# EAGLE design ControlBoardEsp (EAGLE 7.2.0)
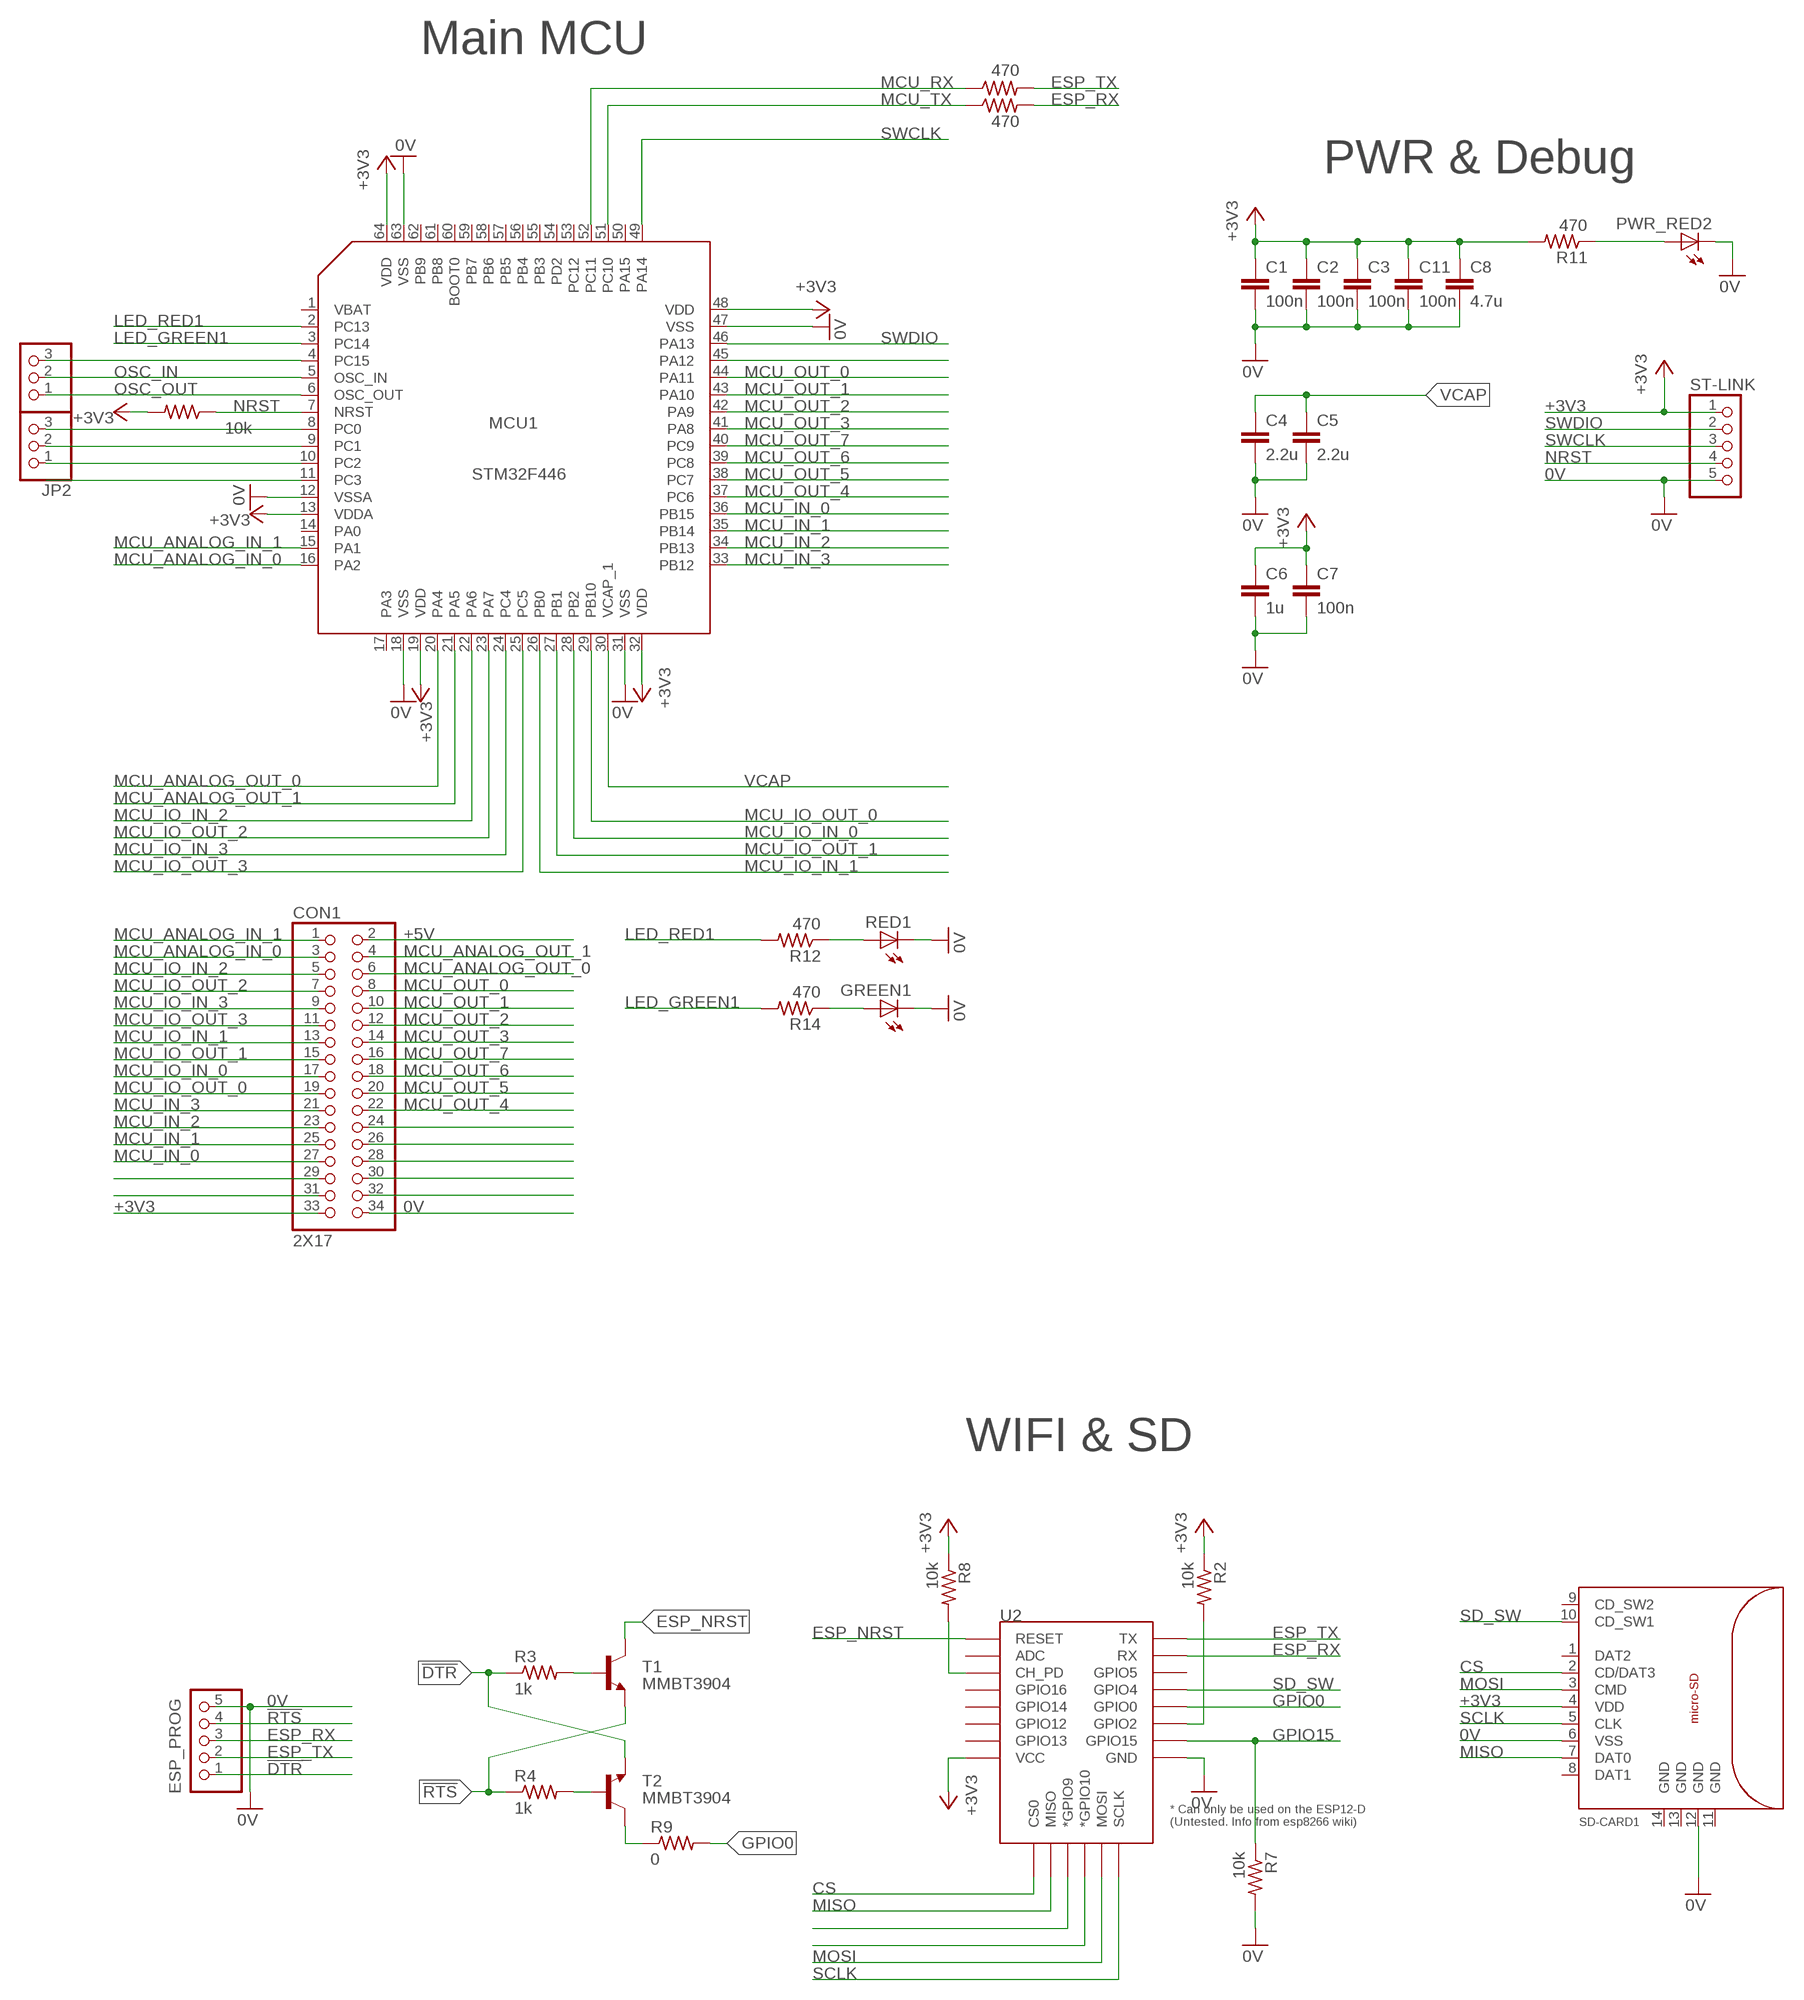
[diagram p0: schematic, sheet 1]

## Parts
C1  100n  C-EUC0402  [C0402]
C2  100n  C-EUC0402  [C0402]
C3  100n  C-EUC0402  [C0402]
C4  2.2u  C-EUC0402  [C0402]
C5  2.2u  C-EUC0402  [C0402]
C6  1u  C-EUC0402  [C0402]
C7  100n  C-EUC0402  [C0402]
C8  4.7u  C-EUC0402  [C0402]
C11  100n  C-EUC0402  [C0402]
CON1  2X17  [2X17]
ESP_PROG  PINHD-1X5  [1X05]
GREEN1  LEDCHIP-LED0805  [CHIP-LED0805]
JP1  PINHD-1X3  [1X03]
JP2  PINHD-1X3  [1X03]
MCU1  STM32F446  [LQFP-64]
PWR_RED2  LEDCHIP-LED0805  [CHIP-LED0805]
R1  10k  R-US_R0402  [R0402]
R2  10k  R-US_R0402  [R0402]
R3  1k  R-US_R0402  [R0402]
R4  1k  R-US_R1206  [R1206]
R5  470  R-US_R0402  [R0402]
R6  470  R-US_R0402  [R0402]
R7  10k  R-US_R0402  [R0402]
R8  10k  R-US_R0402  [R0402]
R9  0  R-US_R1206  [R1206]
R11  470  R-US_R0402  [R0402]
R12  470  R-US_R0402  [R0402]
R14  470  R-US_R0402  [R0402]
RED1  LEDCHIP-LED0805  [CHIP-LED0805]
SD-CARD1  MICRO-SD  [MICRO_SD_FOOTPRINT]
ST-LINK  PINHD-1X5  [1X05]
T1  MMBT3904  MMBT3904LT1-NPN-SOT23-BEC  [SOT23-BEC]
T2  MMBT3904  MMBT3904LT1-NPN-SOT23-BEC  [SOT23-BEC]
U2  ESP12ESMD  [ESP12E-SMD]

## Nets
0V: C1.2 C2.2 C3.2 C4.2 C5.2 C6.2 C7.2 C8.2 C11.2 CON1.34 ESP_PROG.5 GREEN1.C MCU1.12(VSSA) MCU1.18(VSS) MCU1.31(VSS) MCU1.47(VSS) MCU1.63(VSS) PWR_RED2.C R7.2 RED1.C SD-CARD1.6(VSS) SD-CARD1.12(GND) ST-LINK.5 U2.GND
!DTR!: ESP_PROG.1 R3.1 T2.E
!RTS!: ESP_PROG.4 R4.1 T1.E
+3V3: C1.1 C2.1 C3.1 C6.1 C7.1 C8.1 C11.1 CON1.33 MCU1.13(VDDA) MCU1.19(VDD) MCU1.32(VDD) MCU1.48(VDD) MCU1.64(VDD) R1.2 R2.1 R8.1 R11.2 SD-CARD1.4(VDD) ST-LINK.1 U2.VCC
+5V: CON1.2
CS: SD-CARD1.2(CD/DAT3) U2.CS0
ESP_NRST: T1.C U2.RESET
ESP_RX: ESP_PROG.3 R6.2 U2.RXD0(RX)
ESP_TX: ESP_PROG.2 R5.2 U2.TXD0(TX)
GPIO0: R9.2 U2.GPIO0
GPIO15: R7.1 U2.GPIO15
LED_GREEN1: MCU1.3(PC14) R14.2
LED_RED1: MCU1.2(PC13) R12.2
MCU_ANALOG_IN_0: CON1.3 MCU1.16(PA2)
MCU_ANALOG_IN_1: CON1.1 MCU1.15(PA1)
MCU_ANALOG_OUT_0: CON1.6 MCU1.20(PA4)
MCU_ANALOG_OUT_1: CON1.4 MCU1.21(PA5)
MCU_IN_0: CON1.27 MCU1.36(PB15)
MCU_IN_1: CON1.25 MCU1.35(PB14)
MCU_IN_2: CON1.23 MCU1.34(PB13)
MCU_IN_3: CON1.21 MCU1.33(PB12)
MCU_IO_IN_0: CON1.17 MCU1.28(PB2)
MCU_IO_IN_1: CON1.13 MCU1.26(PB0)
MCU_IO_IN_2: CON1.5 MCU1.22(PA6)
MCU_IO_IN_3: CON1.9 MCU1.24(PC4)
MCU_IO_OUT_0: CON1.19 MCU1.29(PB10)
MCU_IO_OUT_1: CON1.15 MCU1.27(PB1)
MCU_IO_OUT_2: CON1.7 MCU1.23(PA7)
MCU_IO_OUT_3: CON1.11 MCU1.25(PC5)
MCU_OUT_0: CON1.8 MCU1.44(PA11)
MCU_OUT_1: CON1.10 MCU1.43(PA10)
MCU_OUT_2: CON1.12 MCU1.42(PA9)
MCU_OUT_3: CON1.14 MCU1.41(PA8)
MCU_OUT_4: CON1.22 MCU1.37(PC6)
MCU_OUT_5: CON1.20 MCU1.38(PC7)
MCU_OUT_6: CON1.18 MCU1.39(PC8)
MCU_OUT_7: CON1.16 MCU1.40(PC9)
MCU_RX: MCU1.52(PC11) R5.1
MCU_TX: MCU1.51(PC10) R6.1
MISO: SD-CARD1.7(DAT0) U2.MISO
MOSI: SD-CARD1.3(CMD) U2.MOSI
N$1: R2.2 U2.GPIO2
N$2: R3.2 T1.B
N$3: R4.2 T2.B
N$4: R8.2 U2.CH_PD
N$5: MCU1.45(PA12)
N$6: R9.1 T2.C
N$7: PWR_RED2.A R11.1
N$8: R12.1 RED1.A
N$9: MCU1.11(PC3)
N$10: JP2.1 MCU1.10(PC2)
N$11: U2.GPIO10(*GPIO10)
N$12: U2.GPIO9(*GPIO9)
N$13: GREEN1.A R14.1
N$14: JP2.2 MCU1.9(PC1)
N$15: JP2.3 MCU1.8(PC0)
N$16: JP1.3 MCU1.4(PC15)
N$123: CON1.29
N$124: CON1.31
N$137: CON1.24
N$138: CON1.26
N$139: CON1.28
N$140: CON1.30
N$141: CON1.32
NRST: MCU1.7(NRST) R1.1 ST-LINK.4
OSC_IN: JP1.2 MCU1.5(OSC_IN)
OSC_OUT: JP1.1 MCU1.6(OSC_OUT)
SCLK: SD-CARD1.5(CLK) U2.SCLK
SD_SW: SD-CARD1.10(CD_SW1) U2.GPIO4
SWCLK: MCU1.49(PA14) ST-LINK.3
SWDIO: MCU1.46(PA13) ST-LINK.2
VCAP: C4.1 C5.1 MCU1.30(VCAP_1)
Unconnected: MCU1.1(VBAT) MCU1.14(PA0) MCU1.17(PA3) MCU1.50(PA15) MCU1.53(PC12) MCU1.54(PD2) MCU1.55(PB3) MCU1.56(PB4) MCU1.57(PB5) MCU1.58(PB6) MCU1.59(PB7) MCU1.60(BOOT0) MCU1.61(PB8) MCU1.62(PB9) SD-CARD1.1(DAT2) SD-CARD1.8(DAT1) SD-CARD1.9(CD_SW2) SD-CARD1.11(GND) SD-CARD1.13(GND) SD-CARD1.14(GND) U2.ADC U2.GPIO5 U2.GPIO12 U2.GPIO13 U2.GPIO14 U2.GPIO16

## Notes on the sheet
- Main MCU
- PWR & Debug
- WIFI & SD

## Library data of the parts
C1-C8 C11 = rcl:C-EU: CAPACITOR, European symbol
CON1 = CardEdgePads:2X17
ESP_PROG ST-LINK = pinhead:PINHD-1X5: PIN HEADER
GREEN1 PWR_RED2 RED1 = led:LED: LED OSRAM: - CHIPLED LG R971, LG N971, LY N971, LG Q971, LY Q971, LO R971, LY R971 LH N974, LH R974 LS Q976, LO Q976, LY Q976 LO Q996 - Hyper CHIPLED LW Q18S LB Q993, LB Q99A, LB R99A - SideLED LS A670, LO A670, LY A670, LG A670, LP A670 LB A673, LV A673, LT A673, LW A673 LH A674 LY A675 LS A676, LA A676, LO A676, LY A676, LW A676 LS A679, LY A679, LG A679 - Hyper Micro SIDELED® LS Y876, LA Y876, LO Y876, LY Y876 LT Y87S - SmartLED LW L88C, LW L88S LB L89C, LB L89S, LG L890 LS L89K, LO L89K, LY L89K LS L896, LA L896, LO L896, LY L896 - TOPLED LS T670, LO T670, LY T670, LG T670, LP T670 LSG T670, LSP T670, LSY T670, LOP T670, LYG T670 LG T671, LOG T671, LSG T671 LB T673, LV T673, LT T673, LW T673 LH T674 LS T676, LA T676, LO T676, LY T676, LB T676, LH T676, LSB T676, LW T676 LB T67C, LV T67C, LT T67C, LS T67K, LO T67K, LY T67K, LW E67C LS E67B, LA E67B, LO E67B, LY E67B, LB E67C, LV E67C, LT E67C LW T67C LS T679, LY T679, LG T679 LS T770, LO T770, LY T770, LG T770, LP T770 LB T773, LV T773, LT T773, LW T773 LH T774 LS E675, LA E675, LY E675, LS T675 LS T776, LA T776, LO T776, LY T776, LB T776 LHGB T686 LT T68C, LB T68C - Hyper Mini TOPLED® LB M676 - Mini TOPLED Santana® LG M470 LS M47K, LO M47K, LY M47K Source: http://www.osram.convergy.de LUXEON: - LUMILED® LXK2-PW12-R00, LXK2-PW12-S00, LXK2-PW14-U00, LXK2-PW14-V00 LXK2-PM12-R00, LXK2-PM12-S00, LXK2-PM14-U00 LXK2-PE12-Q00, LXK2-PE12-R00, LXK2-PE12-S00, LXK2-PE14-T00, LXK2-PE14-U00 LXK2-PB12-K00, LXK2-PB12-L00, LXK2-PB12-M00, LXK2-PB14-N00, LXK2-PB14-P00, LXK2-PB14-Q00 LXK2-PR12-L00, LXK2-PR12-M00, LXK2-PR14-Q00, LXK2-PR14-R00 LXK2-PD12-Q00, LXK2-PD12-R00, LXK2-PD12-S00 LXK2-PH12-R00, LXK2-PH12-S00 LXK2-PL12-P00, LXK2-PL12-Q00, LXK2-PL12-R00 Source: www.luxeon.com KINGBRIGHT: KA-3528ASYC Source: www.kingbright.com
JP1 JP2 = pinhead:PINHD-1X3: PIN HEADER
MCU1 = STM32F446:STM32F446
R1-R9 R11 R12 R14 = rcl:R-US_: RESISTOR, American symbol
SD-CARD1 = microSD-Connector:MICRO-SD
T1 T2 = transistor-neu-to92:*-NPN-: NPN Transistror
U2 = esp8266modules:ESP12E: ESP12E Module

## Board
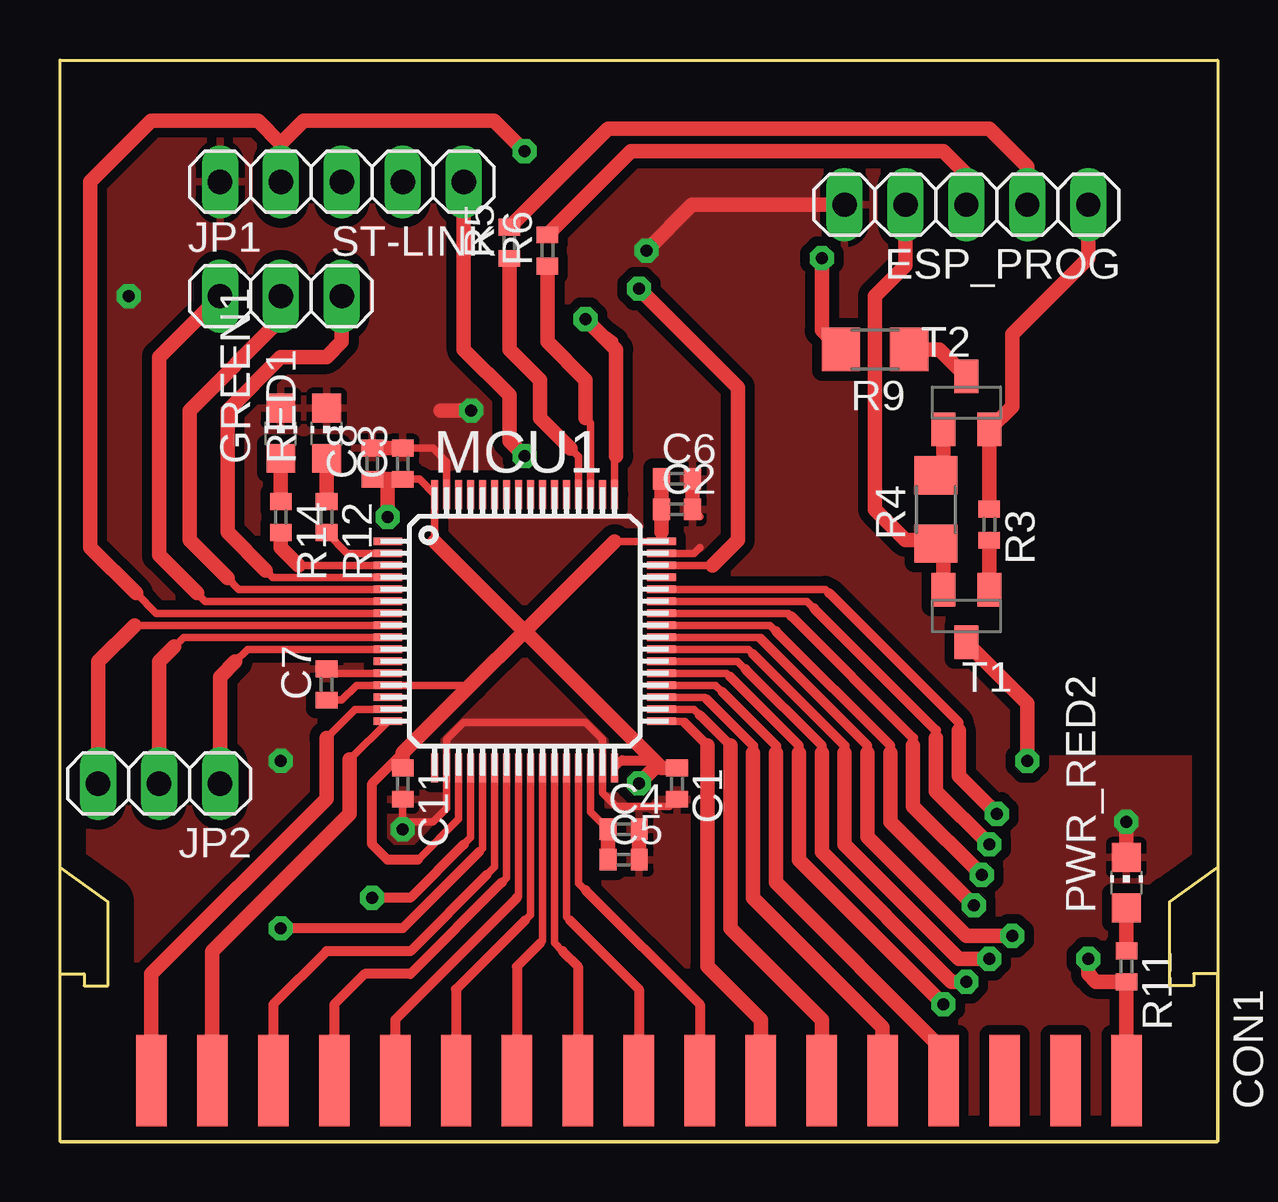
[diagram p1: board, top side]
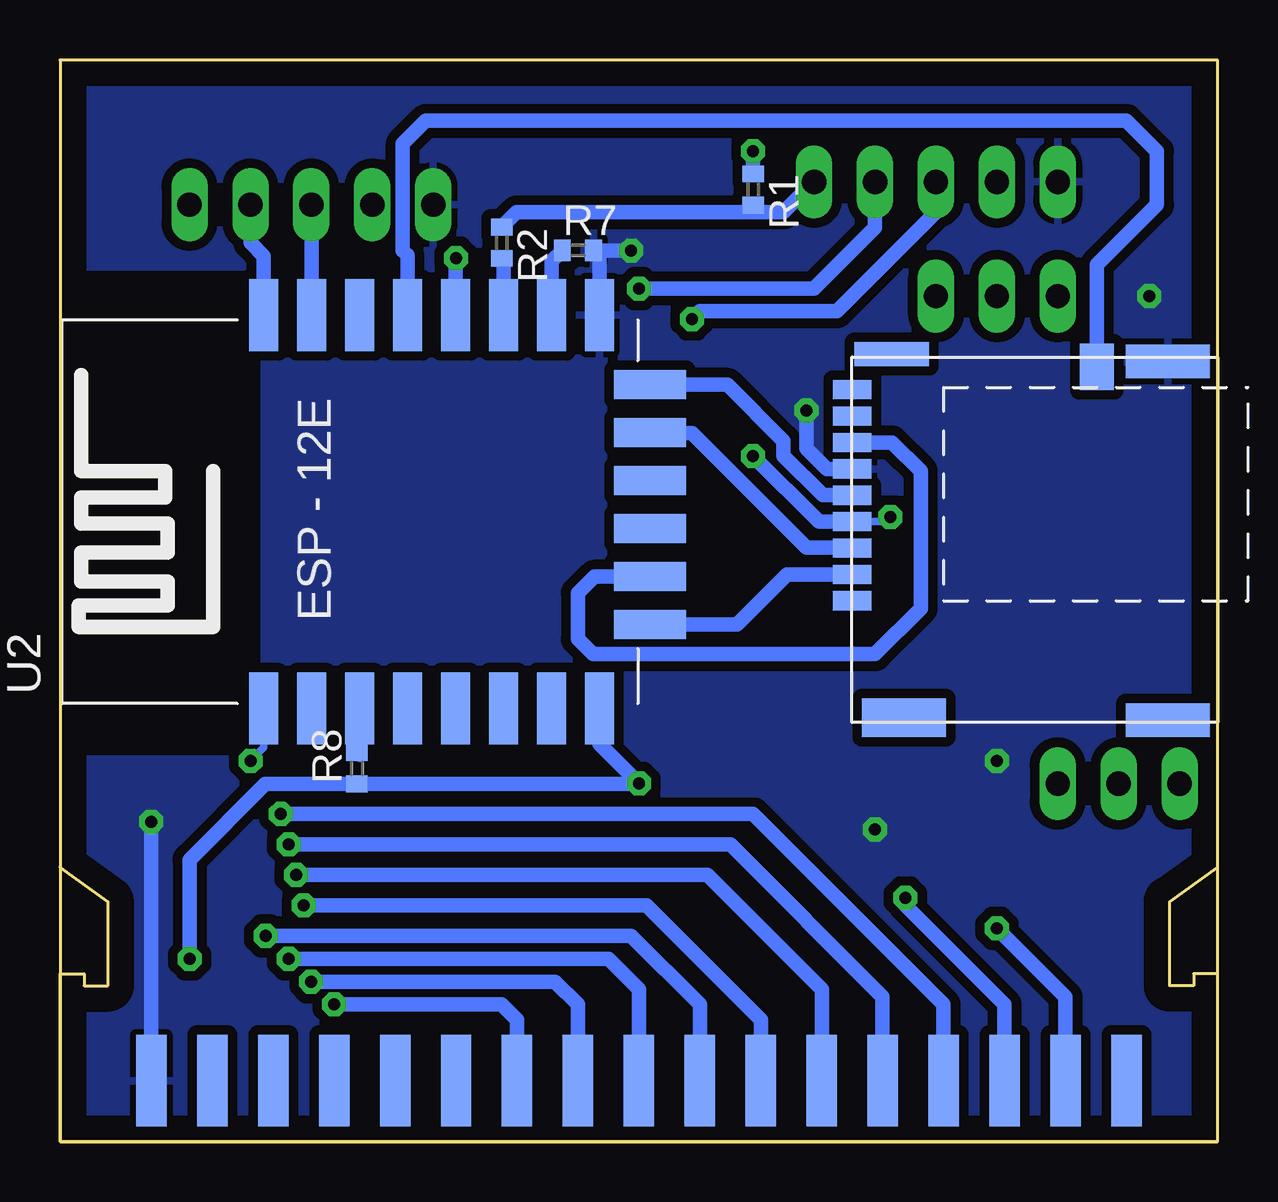
[diagram p2: board, bottom side, seen from below]

Size 48.26 x 45.09 mm. Coordinates in mm from the lower left corner, seen from the top.
Outline: 0,0 0,45.09 48.26,45.09 48.26,0 0,0
Copper layers (1*16): Top 0.035mm / dielectric 1.5mm / Bottom 0.035mm
Design rules "default": minimum track width 10mil, minimum drill 24mil, track to track 8mil, track to pad 8mil, pad to pad 8mil, via to via 8mil, smd to smd 8mil, copper to edge 40mil, drill to drill 8mil, minimum pad ring 10mil, minimum via ring 8mil, stop-mask expansion 4mil, vias tented up to drill 0mil, thermal gap 10mil
tRestrict: area 40.3,16.5 to 48.3,35.9
bRestrict: area 40.3,16.5 to 48.3,35.9

### Footprints (pad centres in the part's own frame; a part is rotated, then mirrored left to right if it is on the bottom)
C0402 = smd 0.7 x 0.9: 1 -0.65,0; 2 0.65,0
2X17 = smd 1.27 x 3.81: 1 -20.32,0; 3 -17.78,0; 5 -15.24,0; 7 -12.7,0; 9 -10.16,0; 11 -7.62,0; 13 -5.08,0; 15 -2.54,0; 17 0,0; 19 2.54,0; 21 5.08,0; 23 7.62,0; 25 10.16,0; 27 12.7,0; 29 15.24,0; 31 17.78,0; 33 20.32,0 | smd 1.27 x 3.81 bottom: 2 -20.32,0; 4 -17.78,0; 6 -15.24,0; 8 -12.7,0; 10 -10.16,0; 12 -7.62,0; 14 -5.08,0; 16 -2.54,0; 18 0,0; 20 2.54,0; 22 5.08,0; 24 7.62,0; 26 10.16,0; 28 12.7,0; 30 15.24,0; 32 17.78,0; 34 20.32,0
1X05 = drill 1.016 long: 1 -5.08,0; 2 -2.54,0; 3 0,0; 4 2.54,0; 5 5.08,0
CHIP-LED0805 = smd 1.2 x 1.2: A 0,-1.05; C 0,1.05
1X03 = drill 1.016 long: 1 -2.54,0; 2 0,0; 3 2.54,0
LQFP-64 = smd 1.2 x 0.3: 1 -5.7,3.75; 2 -5.7,3.25; 3 -5.7,2.75; 4 -5.7,2.25; 5 -5.7,1.75; 6 -5.7,1.25; 7 -5.7,0.75; 8 -5.7,0.25; 9 -5.7,-0.25; 10 -5.7,-0.75; 11 -5.7,-1.25; 12 -5.7,-1.75; 13 -5.7,-2.25; 14 -5.7,-2.75; 15 -5.7,-3.25; 16 -5.7,-3.75; 33 5.7,-3.75; 34 5.7,-3.25; 35 5.7,-2.75; 36 5.7,-2.25; 37 5.7,-1.75; 38 5.7,-1.25; 39 5.7,-0.75; 40 5.7,-0.25; 41 5.7,0.25; 42 5.7,0.75; 43 5.7,1.25; 44 5.7,1.75; 45 5.7,2.25; 46 5.7,2.75; 47 5.7,3.25; 48 5.7,3.75 | smd 0.3 x 1.2: 17 -3.75,-5.7; 18 -3.25,-5.7; 19 -2.75,-5.7; 20 -2.25,-5.7; 21 -1.75,-5.7; 22 -1.25,-5.7; 23 -0.75,-5.7; 24 -0.25,-5.7; 25 0.25,-5.7; 26 0.75,-5.7; 27 1.25,-5.7; 28 1.75,-5.7; 29 2.25,-5.7; 30 2.75,-5.7; 31 3.25,-5.7; 32 3.75,-5.7; 49 3.75,5.7; 50 3.25,5.7; 51 2.75,5.7; 52 2.25,5.7; 53 1.75,5.7; 54 1.25,5.7; 55 0.75,5.7; 56 0.25,5.7; 57 -0.25,5.7; 58 -0.75,5.7; 59 -1.25,5.7; 60 -1.75,5.7; 61 -2.25,5.7; 62 -2.75,5.7; 63 -3.25,5.7; 64 -3.75,5.7
R0402 = smd 0.7 x 0.9: 1 -0.65,0; 2 0.65,0
R1206 = smd 1.6 x 1.803: 1 -1.422,0; 2 1.422,0
MICRO_SD_FOOTPRINT = smd 1.6 x 0.8: 1 -7.62,-2.54; 2 -7.62,-1.44; 3 -7.62,-0.34; 4 -7.62,0.76; 5 -7.62,1.86; 6 -7.62,2.96; 7 -7.62,4.06; 8 -7.62,5.16; 9 -7.62,6.26 | smd 1.4 x 1.95: 10 2.58,7.21 | smd 3.1 x 1: 11 -5.97,7.735 | smd 3.5 x 1.4: 12 5.53,7.435; 13 5.53,-7.515 | smd 3.5 x 1.6: 14 -5.47,-7.415
SOT23-BEC = smd 1 x 1.4: B -0.95,-1.1; C 0,1.1; E 0.95,-1.1
ESP12E-SMD = smd 3 x 1.2: ADC -8.3,3.8; CH_PD -8.3,1.8; GND 8.1,-8.2; GPIO0 8.1,-2.2; GPIO2 8.1,-4.2; GPIO4 8.1,-0.2; GPIO5 8.1,1.8; GPIO12 -8.3,-4.2; GPIO13 -8.3,-6.2; GPIO14 -8.3,-2.2; GPIO15 8.1,-6.2; GPIO16 -8.3,-0.2; RESET -8.3,5.8; RXD0 8.1,3.8; TXD0 8.1,5.8; VCC -8.3,-8.2 | smd 1.2 x 3: CS0 -4.8,-10.3; GPIO9 -0.8,-10.3; GPIO10 1.2,-10.3; MISO -2.8,-10.3; MOSI 3.2,-10.3; SCLK 5.2,-10.3

### Placement (x,y rotation side)
C1  25.72,14.92 270 top
C2  25.72,26.35 0 top
C3  14.29,28.26 90 top
C4  23.5,13.02 0 top
C5  23.5,11.75 0 top
C6  25.72,27.62 0 top
C7  11.11,19.05 90 top
C8  13.02,28.26 90 top
C11  14.29,14.92 270 top
CON1  24.13,2.54 0 top
ESP_PROG  37.78,39.05 180 top
GREEN1  9.21,29.53 0 top
JP1  9.21,35.24 0 top
JP2  4.13,14.92 180 top
MCU1  19.37,21.27 0 top
PWR_RED2  44.45,10.79 0 top
R1  19.37,39.69 270 bottom
R2  29.84,37.47 270 bottom
R3  38.73,25.72 270 top
R4  36.51,26.35 90 top
R5  18.73,37.47 90 top
R6  20.32,37.15 90 top
R7  26.67,37.15 0 bottom
R8  35.88,15.56 90 bottom
R9  33.97,33.02 180 top
R11  44.45,7.3 270 top
R12  11.11,26.04 270 top
R14  9.21,26.04 270 top
RED1  11.11,29.53 0 top
SD-CARD1  7.62,25.08 0 bottom
ST-LINK  11.75,40.01 180 top
T1  37.78,21.91 180 top
T2  37.78,30.8 0 top
U2  33.97,26.35 90 bottom

### Tracks (layer width: path | path; a pad name or v marks a point on that pad's centre or on a via)
0V  (via drill 0.5 pad 1)
  Top 0.305: C2.2 26.67,26.05 | 26.67,24.77 26.43,24.52 MCU1.47 | MCU1.63 16.12,28.33 15.54,28.91 C3.2 | C1.2 25.41,13.97 23.18,13.97 22.62,14.53 MCU1.31 22.62,16.75 21.91,17.46 16.83,17.46 16.12,16.75 MCU1.18 16.12,13.89 15.56,13.34 14.61,13.34 v14.29,13.02 C11.2 | MCU1.12 11.29,19.52 C7.2
  Top 0.61: C4.2 C5.2 | C3.2 C8.2 | v44.45,13.34 PWR_RED2.C | C2.2 C6.2 | v17.14,30.48 15.86,30.48 | v24.45,37.15 26.35,39.05 ESP_PROG.5
  Bottom 0.61: CON1.34 v44.45,13.34 | U2.GND 25.77,36.9 R7.2 v24.45,37.15 | SD-CARD1.6 16.3,28.04 17.14,28.89 v17.14,30.48
  other vias: 9.21,15.88 2.86,35.24
  pour Top (isolate 0.406): 0,0 0,45.09 48.26,45.09 48.26,0
  pour Bottom (isolate 0.406): 0,0 0,45.09 48.26,45.09 48.26,0
!DTR!
  Top 0.61: R3.1 T2.E | T2.E | T2.E 39.69,30.65 39.69,33.66 42.86,36.83 ESP_PROG.1
!RTS!
  Top 0.61: T1.E 36.83,24.61 R4.1 36.36,25.08 35.24,25.08 33.97,26.35 33.97,35.24 35.24,36.51 ESP_PROG.4
+3V3  (via drill 0.5 pad 1)
  Top 0.305: MCU1.32 23.43,15.89 | 23.12,25.02 MCU1.48 25.07,25.39 25.08,25.4 | C3.1 14.98,27.61 MCU1.64 15.62,25.02 | 19.37,21.27 19.38,21.27 | 17.14,19.05 17.12,19.02 MCU1.13 12.36,19.02 11.75,18.41 11.13,18.41 C7.1 | MCU1.19 16.62,13.44 14.92,11.75
  Top 0.406: 23.43,15.89 24.77,15.89 | 14.92,11.75 13.65,11.75 13.02,12.38 13.02,14.92 14.29,16.19
  Top 0.61: C11.1 14.29,16.19 17.14,19.05 19.37,21.27 | 19.37,21.27 23.12,25.02 | C3.1 13.65,27.61 | 13.65,27.61 C8.1 | 15.62,25.02 19.37,21.27 | 19.38,21.27 24.77,15.89 | CON1.33 R11.2 44.44,6.67 43.18,6.67 42.86,6.99 v42.86,7.62 | C6.1 C2.1 25.08,26.34 25.08,25.4 | v24.13,14.92 24.77,15.56 24.77,15.89 | C1.1 25.08,15.57 24.77,15.89 | v19.37,28.57 18.73,29.21 18.73,31.11 16.83,33.02 ST-LINK.1 | v13.65,26.04 13.65,27.61
  Bottom 0.305: SD-CARD1.4 13.85,25.84 v13.65,26.04
  Bottom 0.61: SD-CARD1.4 16.64,25.84 v19.37,28.57 | U2.VCC 25.77,16.57 v24.13,14.92 24.14,14.91 R8.1 39.7,14.91 42.86,11.75 v42.86,7.62 | R2.1 29.23,38.73 19.37,38.73 | 19.37,38.73 18.1,38.73 ST-LINK.1 | R1.2 19.37,38.73
CS
  Bottom 0.61: U2.CS0 20.04,21.55 17.95,23.64 SD-CARD1.2
ESP_NRST  (via drill 0.5 pad 1)
  Top 0.61: v40.32,15.88 40.32,18.27 T1.C
  Bottom 0.305: U2.RESET 39.77,16.43 v40.32,15.88
ESP_RX
  Top 0.61: ESP_PROG.3 37.78,40.32 36.83,41.27 23.8,41.27 R6.2
  Bottom 0.305: ESP_PROG.3
  Bottom 0.61: U2.RXD0 ESP_PROG.3
ESP_TX
  Top 0.61: ESP_PROG.2 40.32,40.64 38.73,42.23 22.84,42.23 R5.2
  Bottom 0.61: U2.TXD0 39.77,36.91 40.32,37.47 ESP_PROG.2
GPIO0  (via drill 0.5 pad 1)
  Top 0.61: v31.75,36.83 31.75,33.82 R9.2
  Bottom 0.305: 31.77,36.81 v31.75,36.83
  Bottom 0.61: U2.GPIO0 31.77,36.81
GPIO15
  Bottom 0.61: R7.1 27.77,36.7 U2.GPIO15
LED_GREEN1
  Top 0.305: MCU1.3 9.95,24.02
  Top 0.61: 9.95,24.02 9.21,24.77 R14.2
LED_RED1
  Top 0.305: MCU1.2 11.97,24.52 R12.2
MCU_ANALOG_IN_0
  Top 0.305: MCU1.16 12.06,15.92
  Top 0.61: CON1.3 6.35,7.62 6.35,7.94 12.06,13.65 12.06,15.92
MCU_ANALOG_IN_1
  Top 0.305: MCU1.15 12.31,18.02 11.11,16.83
  Top 0.61: CON1.1 3.81,6.99 11.11,14.29 11.11,16.83
MCU_ANALOG_OUT_0  (via drill 0.5 pad 1)
  Top 0.305: MCU1.20 17.12,12.67 16.83,12.38 | 14.29,10.16 v13.02,10.16
  Top 0.406: 16.83,12.38 14.61,10.16 v13.02,10.16
  Bottom 0.305: 8.89,1.91 CON1.6
  Bottom 0.61: v13.02,10.16 13.02,9.84 8.89,5.71 CON1.6
MCU_ANALOG_OUT_1  (via drill 0.5 pad 1)
  Top 0.305: MCU1.21 17.62,12.22 17.46,12.06
  Top 0.406: 17.46,12.06 14.29,8.89 v9.21,8.89
  Bottom 0.61: v9.21,8.89 6.35,6.03 CON1.4
MCU_IN_0
  Top 0.305: MCU1.36 27.33,19.02 27.62,18.73
  Top 0.406: 29.84,16.19 29.84,16.51 27.62,18.73
  Top 0.61: CON1.27 36.83,3.81 29.84,10.79 29.84,16.19
MCU_IN_1
  Top 0.305: MCU1.35 26.88,18.52 26.99,18.41
  Top 0.406: 28.89,16.19 28.89,16.51 26.99,18.41
  Top 0.61: CON1.25 34.29,4.76 28.89,10.16 28.89,16.19
MCU_IN_2
  Top 0.305: MCU1.34 26.43,18.02 26.67,17.78
  Top 0.406: 26.67,17.78 27.94,16.51
  Top 0.61: CON1.23 31.75,5.08 27.94,8.89 27.94,16.51
MCU_IN_3
  Top 0.305: MCU1.33 25.98,17.52 26.04,17.46
  Top 0.406: 26.04,17.46 26.99,16.51
  Top 0.61: CON1.21 29.21,5.08 26.99,7.3 26.99,16.51
MCU_IO_IN_0
  Top 0.305: MCU1.28 21.12,9.36 21.27,9.21
  Top 0.406: 21.27,9.21 24.13,6.35 CON1.17
MCU_IO_IN_1
  Top 0.305: MCU1.26 20.12,8.37 20,8.26
  Top 0.406: 20,8.26 19.05,7.3 CON1.13
MCU_IO_IN_2
  Top 0.305: MCU1.22 18.12,11.45 17.78,11.11
  Top 0.406: CON1.5 8.89,5.71 11.11,7.94 14.61,7.94 17.78,11.11
MCU_IO_IN_3
  Top 0.305: MCU1.24 19.12,10.23 19.05,10.16
  Top 0.406: CON1.9 13.97,5.08 19.05,10.16
MCU_IO_OUT_0
  Top 0.305: MCU1.29 21.62,10.77 21.91,10.48
  Top 0.406: 21.91,10.48 26.67,5.71 CON1.19
MCU_IO_OUT_1
  Top 0.305: MCU1.27 20.62,8.28 20.95,7.94
  Top 0.406: 20.95,7.94 21.59,7.3 CON1.15
MCU_IO_OUT_2
  Top 0.305: MCU1.23 18.62,11 18.41,10.79 | 11.43,3.81 CON1.7
  Top 0.406: 18.41,10.79 14.61,6.99 12.7,6.99 11.43,5.71 11.43,3.81
MCU_IO_OUT_3
  Top 0.305: MCU1.25 19.62,9.46 19.37,9.21
  Top 0.406: 19.37,9.21 16.51,6.35 CON1.11
MCU_OUT_0  (via drill 0.5 pad 1)
  Top 0.305: MCU1.44 31.91,23.02 32.07,22.86 | 37.47,17.46 37.47,17.14
  Top 0.406: 32.07,22.86 37.47,17.46
  Top 0.61: v39.05,13.65 37.47,15.24 37.47,17.14
  Bottom 0.61: v39.05,13.65 19.37,13.65 11.43,5.71 CON1.8
MCU_OUT_1  (via drill 0.5 pad 1)
  Top 0.305: MCU1.43 31.14,22.52 31.43,22.23 | 36.51,17.14 36.51,16.83
  Top 0.406: 31.43,22.23 36.51,17.14
  Top 0.61: v38.73,12.38 36.51,14.61 36.51,16.83
  Bottom 0.61: v38.73,12.38 20.32,12.38 13.97,6.03 CON1.10
MCU_OUT_2  (via drill 0.5 pad 1)
  Top 0.305: MCU1.42 30.36,22.02 30.48,21.91 | 35.56,16.83 35.56,16.51
  Top 0.406: 30.48,21.91 35.56,16.83
  Top 0.61: v38.42,11.11 35.56,13.97 35.56,16.51
  Bottom 0.61: v38.42,11.11 21.27,11.11 16.51,6.35 CON1.12
MCU_OUT_3  (via drill 0.5 pad 1)
  Top 0.305: MCU1.41 29.59,21.52 29.84,21.27 | 34.61,16.51 34.61,16.19
  Top 0.406: 29.84,21.27 34.61,16.51
  Top 0.61: v38.1,9.84 34.61,13.34 34.61,16.19
  Bottom 0.61: v38.1,9.84 23.81,9.84 19.05,5.08 CON1.14
MCU_OUT_4  (via drill 0.5 pad 1)
  Top 0.305: MCU1.37 27.79,19.52 27.94,19.37 | 30.8,16.51 30.8,16.19
  Top 0.406: 27.94,19.37 30.8,16.51
  Top 0.61: v36.83,5.71 30.8,11.75 30.8,16.19
  Bottom 0.61: v36.83,5.71 29.84,5.71 29.21,5.08 CON1.22
MCU_OUT_5  (via drill 0.5 pad 1)
  Top 0.305: MCU1.38 28.24,20.02 28.57,19.68 | 31.75,16.51 31.75,16.19
  Top 0.406: 28.57,19.68 31.75,16.51
  Top 0.61: v37.78,6.67 37.15,6.67 31.75,12.06 31.75,16.19
  Bottom 0.61: v37.78,6.67 27.62,6.67 26.67,5.71 CON1.20
MCU_OUT_6  (via drill 0.5 pad 1)
  Top 0.305: MCU1.39 28.69,20.52 28.89,20.32 | 32.7,16.51 32.7,16.19
  Top 0.406: 28.89,20.32 32.7,16.51
  Top 0.61: v38.73,7.62 37.47,7.62 32.7,12.38 32.7,16.19
  Bottom 0.61: v38.73,7.62 25.4,7.62 24.13,6.35 CON1.18
MCU_OUT_7  (via drill 0.5 pad 1)
  Top 0.305: MCU1.40 29.14,21.02 29.21,20.95 | 33.66,16.51 33.66,16.19
  Top 0.406: 29.21,20.95 33.66,16.51
  Top 0.61: v39.69,8.57 37.78,8.57 33.66,12.7 33.66,16.19
  Bottom 0.61: v39.69,8.57 24.45,8.57 21.59,5.71 CON1.16
MCU_RX
  Top 0.305: 21.27,28.89 21.62,28.55 MCU1.52
  Top 0.61: 21.27,28.89 20,30.16 20,31.75 18.73,33.02 R5.1
MCU_TX
  Top 0.305: 21.8,30.37 21.91,30.16 22.12,29.95 MCU1.51
  Top 0.61: R6.1 20.32,33.34 21.91,31.75 21.91,30.16
MISO
  Bottom 0.61: SD-CARD1.7 13.59,29.14 12.38,27.94 12.38,22.23 14.29,20.32 26.04,20.32 26.67,20.95 26.67,22.86 25.98,23.55 U2.MISO
MOSI
  Bottom 0.61: U2.MOSI 23.65,29.53 21.91,29.53 17.14,24.77 15.26,24.77 SD-CARD1.3
N$1
  Bottom 0.61: R2.2 29.77,36.74 U2.GPIO2
N$2
  Top 0.61: R3.2 T1.B
N$3
  Top 0.61: T2.B 36.83,28.09 R4.2
N$4
  Bottom 0.305: U2.CH_PD 35.77,15.96 R8.2
N$6
  Top 0.61: R9.1 36.66,33.02 T2.C
N$7
  Top 0.61: PWR_RED2.A R11.1
N$8
  Top 0.61: R12.1 RED1.A
N$10
  Top 0.305: MCU1.10 7.94,20.52 7.82,20.52 7.3,20
  Top 0.61: JP2.1 6.67,19.37 7.3,20
N$13
  Top 0.61: R14.1 GREEN1.A
N$14
  Top 0.305: MCU1.9 5.15,21.02 4.76,20.64
  Top 0.61: JP2.2 4.13,20 4.76,20.64
N$15
  Top 0.305: MCU1.8 3.11,21.52
  Top 0.61: JP2.3 1.59,20 3.11,21.52
N$16
  Top 0.305: MCU1.4 8.86,23.52 8.57,23.81
  Top 0.61: JP1.3 11.75,33.34 11.11,32.7 9.21,32.7 6.99,30.48 6.99,25.4 8.57,23.81
NRST  (via drill 0.5 pad 1)
  Top 0.305: 3.17,22.86 4.01,22.02 MCU1.7
  Top 0.61: ST-LINK.4 9.21,41.59 | 9.21,41.59 8.26,42.55 3.81,42.55 1.27,40.01 1.27,24.77 3.17,22.86 | 9.21,41.59 10.16,42.55 18.1,42.55 v19.37,41.27
  Bottom 0.61: v19.37,41.27 R1.1
OSC_IN
  Top 0.305: MCU1.5 7.46,23.02 6.99,23.5
  Top 0.61: JP1.2 9.21,34.29 5.4,30.48 5.4,25.08 6.99,23.5
OSC_OUT
  Top 0.305: MCU1.6 6.05,22.52 5.71,22.86
  Top 0.61: JP1.1 4.13,32.7 4.13,24.45 5.71,22.86
SCLK
  Bottom 0.61: SD-CARD1.5 16.46,26.94 18.1,28.57 18.1,29.21 20.44,31.55 U2.SCLK
SD_SW
  Bottom 0.61: U2.GPIO4 33.77,36.95 33.97,37.15 33.97,41.59 33.02,42.55 3.81,42.55 2.54,41.27 2.54,39.05 5.04,36.55 SD-CARD1.10
SWCLK  (via drill 0.5 pad 1)
  Top 0.305: 23.12,33.4 v21.91,34.29 | MCU1.49 23.12,28.52 23.18,28.57
  Top 0.61: 23.18,28.57 23.18,33.02 v21.91,34.29
  Bottom 0.61: v21.91,34.29 21.59,34.61 15.88,34.61 11.75,38.73 ST-LINK.3
SWDIO  (via drill 0.5 pad 1)
  Top 0.305: MCU1.46 27.2,24.02
  Top 0.61: 27.2,24.02 28.26,25.08 28.26,31.43 v24.13,35.56
  Bottom 0.61: ST-LINK.2 14.29,38.1 16.83,35.56 v24.13,35.56
VCAP
  Top 0.305: MCU1.30 22.12,13.74 C4.1
  Top 0.61: C4.1 C5.1